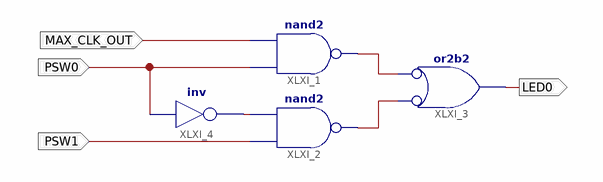
[diagram p0: schematic sheet 1]
// Xilinx ISE schematic lab4_mux1.sch (spartan3) as structural Verilog: 4 symbols, 4 ports
module lab4_mux1 (
  input  MAX_CLK_OUT,
  input  PSW0,
  input  PSW1,
  output LED0
);

  wire XLXN_1, XLXN_6, XLXN_7;

  nand XLXI_1 (XLXN_6, PSW0, MAX_CLK_OUT);
  nand XLXI_2 (XLXN_7, PSW1, XLXN_1);
  or XLXI_3 (LED0, ~XLXN_7, ~XLXN_6);  // or2b2
  not XLXI_4 (XLXN_1, PSW0);
endmodule
